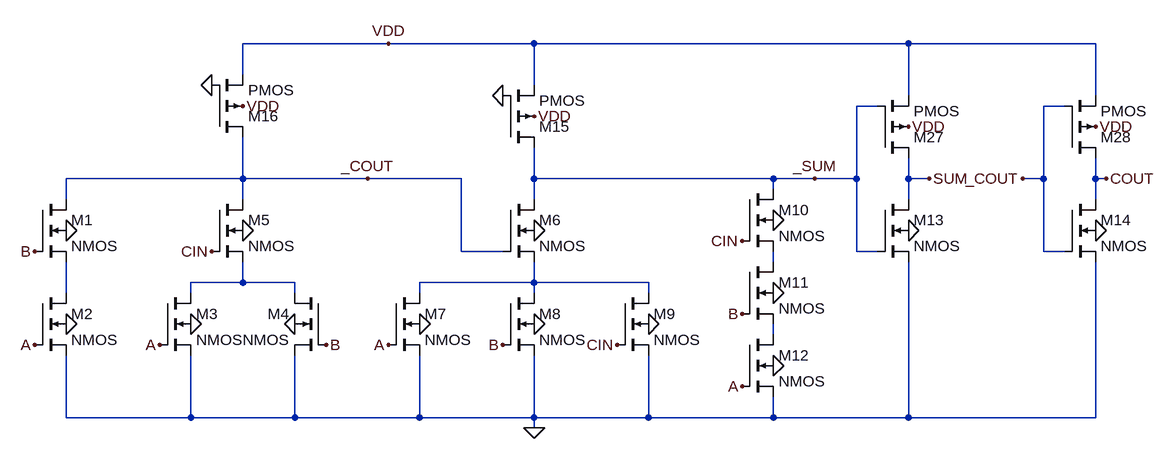
[diagram p0: schematic FA_pseudo.asc]
FA_pseudo.asc, the LTspice schematic file:
Version 4
SHEET 1 1296 680
WIRE 112 -32 -112 -32
WIRE 336 -32 112 -32
WIRE 912 -32 336 -32
WIRE 1200 -32 912 -32
WIRE -112 16 -112 -32
WIRE 336 32 336 -32
WIRE 912 48 912 -32
WIRE 1200 48 1200 -32
WIRE 864 64 832 64
WIRE 1152 64 1120 64
WIRE -112 176 -112 112
WIRE -112 176 -384 176
WIRE 80 176 -112 176
WIRE 224 176 80 176
WIRE 336 176 336 128
WIRE 704 176 336 176
WIRE 768 176 704 176
WIRE 832 176 832 64
WIRE 832 176 768 176
WIRE 912 176 912 144
WIRE 944 176 912 176
WIRE 1120 176 1120 64
WIRE 1120 176 1088 176
WIRE 1200 176 1200 144
WIRE 1216 176 1200 176
WIRE 704 192 704 176
WIRE -384 208 -384 176
WIRE -112 208 -112 176
WIRE 336 208 336 176
WIRE 912 208 912 176
WIRE 1200 208 1200 176
WIRE 224 288 224 176
WIRE 288 288 224 288
WIRE 832 288 832 176
WIRE 864 288 832 288
WIRE 1120 288 1120 176
WIRE 1152 288 1120 288
WIRE 704 304 704 288
WIRE -112 336 -112 304
WIRE -112 336 -192 336
WIRE -32 336 -112 336
WIRE 336 336 336 304
WIRE 336 336 160 336
WIRE 512 336 336 336
WIRE -384 352 -384 304
WIRE -192 352 -192 336
WIRE -32 352 -32 336
WIRE 160 352 160 336
WIRE 336 352 336 336
WIRE 512 352 512 336
WIRE 704 416 704 400
WIRE -384 544 -384 448
WIRE -192 544 -192 448
WIRE -192 544 -384 544
WIRE -32 544 -32 448
WIRE -32 544 -192 544
WIRE 160 544 160 448
WIRE 160 544 -32 544
WIRE 336 544 336 448
WIRE 336 544 160 544
WIRE 512 544 512 448
WIRE 512 544 336 544
WIRE 704 544 704 512
WIRE 704 544 512 544
WIRE 912 544 912 304
WIRE 912 544 704 544
WIRE 1200 544 1200 304
WIRE 1200 544 912 544
WIRE 336 560 336 544
FLAG -432 432 A
FLAG -240 432 A
FLAG 112 432 A
FLAG 656 496 A
FLAG -432 288 B
FLAG 16 432 B
FLAG 288 432 B
FLAG 656 384 B
FLAG -160 288 CIN
FLAG 464 432 CIN
FLAG 656 272 CIN
FLAG -384 400 0
FLAG -384 256 0
FLAG -112 256 0
FLAG -192 400 0
FLAG -32 400 0
FLAG 160 400 0
FLAG 336 256 0
FLAG 512 400 0
FLAG 336 400 0
FLAG 704 464 0
FLAG 704 352 0
FLAG 704 240 0
FLAG 912 256 0
FLAG 1200 256 0
FLAG 912 96 VDD
FLAG 1200 96 VDD
FLAG 944 176 SUM
FLAG 1088 176 _COUT
FLAG 1216 176 COUT
FLAG 80 176 _COUT
FLAG 336 560 0
FLAG 288 48 0
FLAG -160 32 0
FLAG 112 -32 VDD
FLAG -112 64 VDD
FLAG 336 80 VDD
FLAG 768 176 _SUM
SYMBOL nmos4 -432 208 R0
SYMATTR InstName M1
SYMBOL nmos4 -432 352 R0
SYMATTR InstName M2
SYMBOL nmos4 -240 352 R0
SYMATTR InstName M3
SYMBOL nmos4 16 352 M0
SYMATTR InstName M4
SYMBOL nmos4 -160 208 R0
SYMATTR InstName M5
SYMBOL nmos4 288 208 R0
SYMATTR InstName M6
SYMBOL nmos4 112 352 R0
SYMATTR InstName M7
SYMBOL nmos4 288 352 R0
SYMATTR InstName M8
SYMBOL nmos4 464 352 R0
SYMATTR InstName M9
SYMBOL nmos4 656 192 R0
SYMATTR InstName M10
SYMBOL nmos4 656 304 R0
SYMATTR InstName M11
SYMBOL nmos4 656 416 R0
SYMATTR InstName M12
SYMBOL nmos4 864 208 R0
SYMATTR InstName M13
SYMBOL nmos4 1152 208 R0
SYMATTR InstName M14
SYMBOL pmos4 864 144 M180
SYMATTR InstName M27
SYMBOL pmos4 1152 144 M180
SYMATTR InstName M28
SYMBOL pmos4 288 128 M180
SYMATTR InstName M15
SYMBOL pmos4 -160 112 M180
SYMATTR InstName M16

The netlist it stands for:
* FA_pseudo.asc
M1 _COUT B N004 0 NMOS
M2 N004 A 0 0 NMOS
M3 N002 A 0 0 NMOS
M4 N002 B 0 0 NMOS
M5 _COUT CIN N002 0 NMOS
M6 _SUM _COUT N003 0 NMOS
M7 N003 A 0 0 NMOS
M8 N003 B 0 0 NMOS
M9 N003 CIN 0 0 NMOS
M10 _SUM CIN N001 0 NMOS
M11 N001 B N005 0 NMOS
M12 N005 A 0 0 NMOS
M13 SUM _SUM 0 0 NMOS
M14 COUT _COUT 0 0 NMOS
M27 SUM _SUM VDD VDD PMOS
M28 COUT _COUT VDD VDD PMOS
M15 _SUM 0 VDD VDD PMOS
M16 _COUT 0 VDD VDD PMOS
.model NMOS NMOS
.model PMOS PMOS
.lib standard.mos
.backanno
.end